# Altium schematic sheet Connectors.SchDoc: Connectors
size B; DrawnBy: Jasper Yun; SheetNumber: 2; SheetTotal: 12; Competition: SAC 2021; Subteam: Avionics; University: McGill University; Location: Montreal, Quebec; Project: Avionics Project Name; MRT: McGill Rocket Team
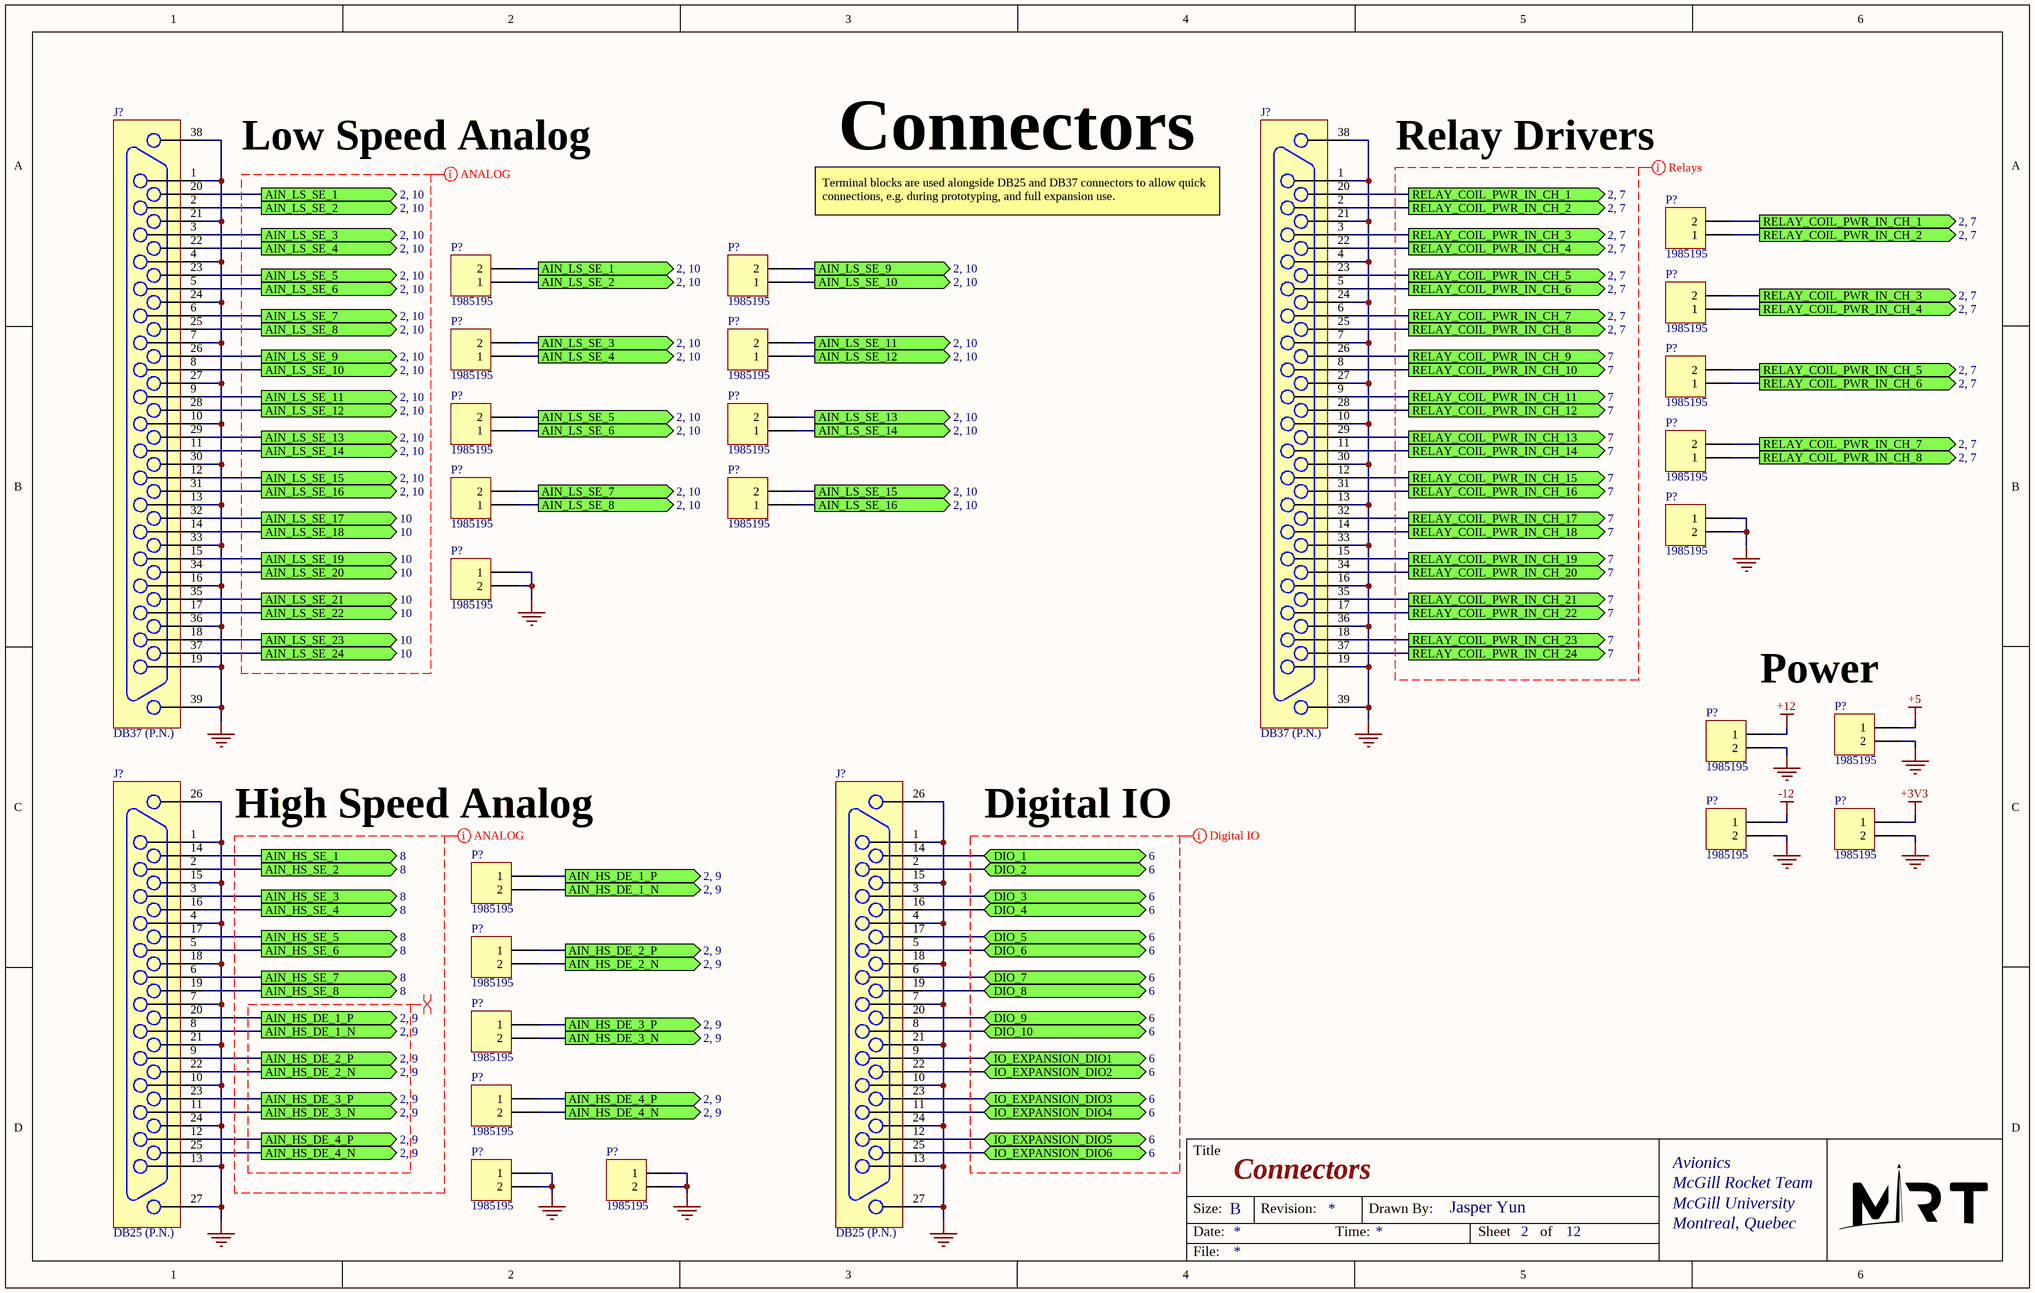
[diagram p0: Connectors.SchDoc]

## Parts
(Parts that share a designator on the sheet are numbered #1, #2 ... from top to bottom, then left to right.)
J?#1  DB37 (P.N.)
J?#2  DB37 (P.N.)
J?#3  DB25 (P.N.)
J?#4  DB25 (P.N.)
P?#1  1985195  [Terminal Block 1985195 2-pos 3.5mm pitch]
P?#2  1985195  [Terminal Block 1985195 2-pos 3.5mm pitch]
P?#3  1985195  [Terminal Block 1985195 2-pos 3.5mm pitch]
P?#4  1985195  [Terminal Block 1985195 2-pos 3.5mm pitch]
P?#5  1985195  [Terminal Block 1985195 2-pos 3.5mm pitch]
P?#6  1985195  [Terminal Block 1985195 2-pos 3.5mm pitch]
P?#7  1985195  [Terminal Block 1985195 2-pos 3.5mm pitch]
P?#8  1985195  [Terminal Block 1985195 2-pos 3.5mm pitch]
P?#9  1985195  [Terminal Block 1985195 2-pos 3.5mm pitch]
P?#10  1985195  [Terminal Block 1985195 2-pos 3.5mm pitch]
P?#11  1985195  [Terminal Block 1985195 2-pos 3.5mm pitch]
P?#12  1985195  [Terminal Block 1985195 2-pos 3.5mm pitch]
P?#13  1985195  [Terminal Block 1985195 2-pos 3.5mm pitch]
P?#14  1985195  [Terminal Block 1985195 2-pos 3.5mm pitch]
P?#15  1985195  [Terminal Block 1985195 2-pos 3.5mm pitch]
P?#16  1985195  [Terminal Block 1985195 2-pos 3.5mm pitch]
P?#17  1985195  [Terminal Block 1985195 2-pos 3.5mm pitch]
P?#18  1985195  [Terminal Block 1985195 2-pos 3.5mm pitch]
P?#19  1985195  [Terminal Block 1985195 2-pos 3.5mm pitch]
P?#20  1985195  [Terminal Block 1985195 2-pos 3.5mm pitch]
P?#21  1985195  [Terminal Block 1985195 2-pos 3.5mm pitch]
P?#22  1985195  [Terminal Block 1985195 2-pos 3.5mm pitch]
P?#23  1985195  [Terminal Block 1985195 2-pos 3.5mm pitch]
P?#24  1985195  [Terminal Block 1985195 2-pos 3.5mm pitch]

## Ports
AIN_HS_DE_1_N (out, see 2, 9), AIN_HS_DE_1_P (out, see 2, 9), AIN_HS_DE_2_N (out, see 2, 9), AIN_HS_DE_2_P (out, see 2, 9), AIN_HS_DE_3_N (out, see 2, 9), AIN_HS_DE_3_P (out, see 2, 9), AIN_HS_DE_4_N (out, see 2, 9), AIN_HS_DE_4_P (out, see 2, 9), AIN_HS_SE_1 (out, see 8), AIN_HS_SE_2 (out, see 8), AIN_HS_SE_3 (out, see 8), AIN_HS_SE_4 (out, see 8), AIN_HS_SE_5 (out, see 8), AIN_HS_SE_6 (out, see 8), AIN_HS_SE_7 (out, see 8), AIN_HS_SE_8 (out, see 8), AIN_LS_SE_1 (out, see 2, 10), AIN_LS_SE_2 (out, see 2, 10), AIN_LS_SE_3 (out, see 2, 10), AIN_LS_SE_4 (out, see 2, 10), AIN_LS_SE_5 (out, see 2, 10), AIN_LS_SE_6 (out, see 2, 10), AIN_LS_SE_7 (out, see 2, 10), AIN_LS_SE_8 (out, see 2, 10), AIN_LS_SE_9 (out, see 2, 10), AIN_LS_SE_10 (out, see 2, 10), AIN_LS_SE_11 (out, see 2, 10), AIN_LS_SE_12 (out, see 2, 10), AIN_LS_SE_13 (out, see 2, 10), AIN_LS_SE_14 (out, see 2, 10), AIN_LS_SE_15 (out, see 2, 10), AIN_LS_SE_16 (out, see 2, 10), AIN_LS_SE_17 (out, see 10), AIN_LS_SE_18 (out, see 10), AIN_LS_SE_19 (out, see 10), AIN_LS_SE_20 (out, see 10), AIN_LS_SE_21 (out, see 10), AIN_LS_SE_22 (out, see 10), AIN_LS_SE_23 (out, see 10), AIN_LS_SE_24 (out, see 10), DIO_1 (bidir, see 6), DIO_2 (bidir, see 6), DIO_3 (bidir, see 6), DIO_4 (bidir, see 6), DIO_5 (bidir, see 6), DIO_6 (bidir, see 6), DIO_7 (bidir, see 6), DIO_8 (bidir, see 6), DIO_9 (bidir, see 6), DIO_10 (bidir, see 6), IO_EXPANSION_DIO1 (bidir, see 6), IO_EXPANSION_DIO2 (bidir, see 6), IO_EXPANSION_DIO3 (bidir, see 6), IO_EXPANSION_DIO4 (bidir, see 6), IO_EXPANSION_DIO5 (bidir, see 6), IO_EXPANSION_DIO6 (bidir, see 6), RELAY_COIL_PWR_IN_CH_1 (out, see 2, 7), RELAY_COIL_PWR_IN_CH_2 (out, see 2, 7), RELAY_COIL_PWR_IN_CH_3 (out, see 2, 7), RELAY_COIL_PWR_IN_CH_4 (out, see 2, 7), RELAY_COIL_PWR_IN_CH_5 (out, see 2, 7), RELAY_COIL_PWR_IN_CH_6 (out, see 2, 7), RELAY_COIL_PWR_IN_CH_7 (out, see 2, 7), RELAY_COIL_PWR_IN_CH_8 (out, see 2, 7), RELAY_COIL_PWR_IN_CH_9 (out, see 7), RELAY_COIL_PWR_IN_CH_10 (out, see 7), RELAY_COIL_PWR_IN_CH_11 (out, see 7), RELAY_COIL_PWR_IN_CH_12 (out, see 7), RELAY_COIL_PWR_IN_CH_13 (out, see 7), RELAY_COIL_PWR_IN_CH_14 (out, see 7), RELAY_COIL_PWR_IN_CH_15 (out, see 7), RELAY_COIL_PWR_IN_CH_16 (out, see 7), RELAY_COIL_PWR_IN_CH_17 (out, see 7), RELAY_COIL_PWR_IN_CH_18 (out, see 7), RELAY_COIL_PWR_IN_CH_19 (out, see 7), RELAY_COIL_PWR_IN_CH_20 (out, see 7), RELAY_COIL_PWR_IN_CH_21 (out, see 7), RELAY_COIL_PWR_IN_CH_22 (out, see 7), RELAY_COIL_PWR_IN_CH_23 (out, see 7), RELAY_COIL_PWR_IN_CH_24 (out, see 7)

## Nets
+3V3: P?#18.1
+5: P?#15.1
+12: P?#16.1
-12: P?#17.1
GND: J?#1.1 J?#1.4 J?#1.7 J?#1.10 J?#1.13 J?#1.16 J?#1.19 J?#1.21 J?#1.24 J?#1.27 J?#1.30 J?#1.33 J?#1.36 J?#1.38 J?#1.39 J?#2.1 J?#2.4 J?#2.7 J?#2.10 J?#2.13 J?#2.16 J?#2.19 J?#2.21 J?#2.24 J?#2.27 J?#2.30 J?#2.33 J?#2.36 J?#2.38 J?#2.39 J?#3.1 J?#3.4 J?#3.7 J?#3.10 J?#3.13 J?#3.15 J?#3.18 J?#3.21 J?#3.24 J?#3.26 J?#3.27 J?#4.1 J?#4.4 J?#4.7 J?#4.10 J?#4.13 J?#4.15 J?#4.18 J?#4.21 J?#4.24 J?#4.26 J?#4.27 P?#11.1 P?#11.2 P?#14.1 P?#14.2 P?#15.2 P?#16.2 P?#17.2 P?#18.2 P?#23.1 P?#23.2 P?#24.1 P?#24.2
AIN_HS_DE_1_N: J?#3.8 P?#19.2 ; port AIN_HS_DE_1_N
AIN_HS_DE_1_P: J?#3.20 P?#19.1 ; port AIN_HS_DE_1_P
AIN_HS_DE_2_N: J?#3.22 P?#20.2 ; port AIN_HS_DE_2_N
AIN_HS_DE_2_P: J?#3.9 P?#20.1 ; port AIN_HS_DE_2_P
AIN_HS_DE_3_N: J?#3.11 P?#21.2 ; port AIN_HS_DE_3_N
AIN_HS_DE_3_P: J?#3.23 P?#21.1 ; port AIN_HS_DE_3_P
AIN_HS_DE_4_N: J?#3.25 P?#22.2 ; port AIN_HS_DE_4_N
AIN_HS_DE_4_P: J?#3.12 P?#22.1 ; port AIN_HS_DE_4_P
AIN_HS_SE_1: J?#3.14 ; port AIN_HS_SE_1
AIN_HS_SE_2: J?#3.2 ; port AIN_HS_SE_2
AIN_HS_SE_3: J?#3.3 ; port AIN_HS_SE_3
AIN_HS_SE_4: J?#3.16 ; port AIN_HS_SE_4
AIN_HS_SE_5: J?#3.17 ; port AIN_HS_SE_5
AIN_HS_SE_6: J?#3.5 ; port AIN_HS_SE_6
AIN_HS_SE_7: J?#3.6 ; port AIN_HS_SE_7
AIN_HS_SE_8: J?#3.19 ; port AIN_HS_SE_8
AIN_LS_SE_1: J?#1.20 P?#2.2 ; port AIN_LS_SE_1
AIN_LS_SE_2: J?#1.2 P?#2.1 ; port AIN_LS_SE_2
AIN_LS_SE_3: J?#1.3 P?#5.2 ; port AIN_LS_SE_3
AIN_LS_SE_4: J?#1.22 P?#5.1 ; port AIN_LS_SE_4
AIN_LS_SE_5: J?#1.23 P?#8.2 ; port AIN_LS_SE_5
AIN_LS_SE_6: J?#1.5 P?#8.1 ; port AIN_LS_SE_6
AIN_LS_SE_7: J?#1.6 P?#12.2 ; port AIN_LS_SE_7
AIN_LS_SE_8: J?#1.25 P?#12.1 ; port AIN_LS_SE_8
AIN_LS_SE_9: J?#1.26 P?#3.2 ; port AIN_LS_SE_9
AIN_LS_SE_10: J?#1.8 P?#3.1 ; port AIN_LS_SE_10
AIN_LS_SE_11: J?#1.9 P?#6.2 ; port AIN_LS_SE_11
AIN_LS_SE_12: J?#1.28 P?#6.1 ; port AIN_LS_SE_12
AIN_LS_SE_13: J?#1.29 P?#9.2 ; port AIN_LS_SE_13
AIN_LS_SE_14: J?#1.11 P?#9.1 ; port AIN_LS_SE_14
AIN_LS_SE_15: J?#1.12 P?#13.2 ; port AIN_LS_SE_15
AIN_LS_SE_16: J?#1.31 P?#13.1 ; port AIN_LS_SE_16
AIN_LS_SE_17: J?#1.32 ; port AIN_LS_SE_17
AIN_LS_SE_18: J?#1.14 ; port AIN_LS_SE_18
AIN_LS_SE_19: J?#1.15 ; port AIN_LS_SE_19
AIN_LS_SE_20: J?#1.34 ; port AIN_LS_SE_20
AIN_LS_SE_21: J?#1.35 ; port AIN_LS_SE_21
AIN_LS_SE_22: J?#1.17 ; port AIN_LS_SE_22
AIN_LS_SE_23: J?#1.18 ; port AIN_LS_SE_23
AIN_LS_SE_24: J?#1.37 ; port AIN_LS_SE_24
DIO_1: J?#4.14 ; port DIO_1
DIO_2: J?#4.2 ; port DIO_2
DIO_3: J?#4.3 ; port DIO_3
DIO_4: J?#4.16 ; port DIO_4
DIO_5: J?#4.17 ; port DIO_5
DIO_6: J?#4.5 ; port DIO_6
DIO_7: J?#4.6 ; port DIO_7
DIO_8: J?#4.19 ; port DIO_8
DIO_9: J?#4.20 ; port DIO_9
DIO_10: J?#4.8 ; port DIO_10
IO_EXPANSION_DIO1: J?#4.9 ; port IO_EXPANSION_DIO1
IO_EXPANSION_DIO2: J?#4.22 ; port IO_EXPANSION_DIO2
IO_EXPANSION_DIO3: J?#4.23 ; port IO_EXPANSION_DIO3
IO_EXPANSION_DIO4: J?#4.11 ; port IO_EXPANSION_DIO4
IO_EXPANSION_DIO5: J?#4.12 ; port IO_EXPANSION_DIO5
IO_EXPANSION_DIO6: J?#4.25 ; port IO_EXPANSION_DIO6
RELAY_COIL_PWR_IN_CH_1: J?#2.20 P?#1.2 ; port RELAY_COIL_PWR_IN_CH_1
RELAY_COIL_PWR_IN_CH_2: J?#2.2 P?#1.1 ; port RELAY_COIL_PWR_IN_CH_2
RELAY_COIL_PWR_IN_CH_3: J?#2.3 P?#4.2 ; port RELAY_COIL_PWR_IN_CH_3
RELAY_COIL_PWR_IN_CH_4: J?#2.22 P?#4.1 ; port RELAY_COIL_PWR_IN_CH_4
RELAY_COIL_PWR_IN_CH_5: J?#2.23 P?#7.2 ; port RELAY_COIL_PWR_IN_CH_5
RELAY_COIL_PWR_IN_CH_6: J?#2.5 P?#7.1 ; port RELAY_COIL_PWR_IN_CH_6
RELAY_COIL_PWR_IN_CH_7: J?#2.6 P?#10.2 ; port RELAY_COIL_PWR_IN_CH_7
RELAY_COIL_PWR_IN_CH_8: J?#2.25 P?#10.1 ; port RELAY_COIL_PWR_IN_CH_8
RELAY_COIL_PWR_IN_CH_9: J?#2.26 ; port RELAY_COIL_PWR_IN_CH_9
RELAY_COIL_PWR_IN_CH_10: J?#2.8 ; port RELAY_COIL_PWR_IN_CH_10
RELAY_COIL_PWR_IN_CH_11: J?#2.9 ; port RELAY_COIL_PWR_IN_CH_11
RELAY_COIL_PWR_IN_CH_12: J?#2.28 ; port RELAY_COIL_PWR_IN_CH_12
RELAY_COIL_PWR_IN_CH_13: J?#2.29 ; port RELAY_COIL_PWR_IN_CH_13
RELAY_COIL_PWR_IN_CH_14: J?#2.11 ; port RELAY_COIL_PWR_IN_CH_14
RELAY_COIL_PWR_IN_CH_15: J?#2.12 ; port RELAY_COIL_PWR_IN_CH_15
RELAY_COIL_PWR_IN_CH_16: J?#2.31 ; port RELAY_COIL_PWR_IN_CH_16
RELAY_COIL_PWR_IN_CH_17: J?#2.32 ; port RELAY_COIL_PWR_IN_CH_17
RELAY_COIL_PWR_IN_CH_18: J?#2.14 ; port RELAY_COIL_PWR_IN_CH_18
RELAY_COIL_PWR_IN_CH_19: J?#2.15 ; port RELAY_COIL_PWR_IN_CH_19
RELAY_COIL_PWR_IN_CH_20: J?#2.34 ; port RELAY_COIL_PWR_IN_CH_20
RELAY_COIL_PWR_IN_CH_21: J?#2.35 ; port RELAY_COIL_PWR_IN_CH_21
RELAY_COIL_PWR_IN_CH_22: J?#2.17 ; port RELAY_COIL_PWR_IN_CH_22
RELAY_COIL_PWR_IN_CH_23: J?#2.18 ; port RELAY_COIL_PWR_IN_CH_23
RELAY_COIL_PWR_IN_CH_24: J?#2.37 ; port RELAY_COIL_PWR_IN_CH_24

## Layout directives
differential pair: (no net found under the mark)
net class ANALOG: (no net found under the mark)
net class Digital IO: (no net found under the mark)
net class Relays: (no net found under the mark)

## Notes on the sheet
- Low Speed Analog
- Relay Drivers
- Terminal blocks are used alongside DB25 and DB37 connectors to allow quick connections, e.g. during prototyping, and full expansion use.
- (near P?#15) Power
- High Speed Analog
- Digital IO
- Title
- Size:
- Date:
- B
- Revision:
- Time:
- Drawn By:
- Sheet
- of
- File:

## Library data of the parts
J?#1 J?#2 = Connector DB37 (P.N.)
J?#3 J?#4 = Connector DB25 (P.N)
P?#1-P?#24 = Header 2: Header, 2-Pin; LatestRevisionDate: 17-Jul-2002; LatestRevisionNote: Re-released for DXP Platform.; Publisher: Altium Limited